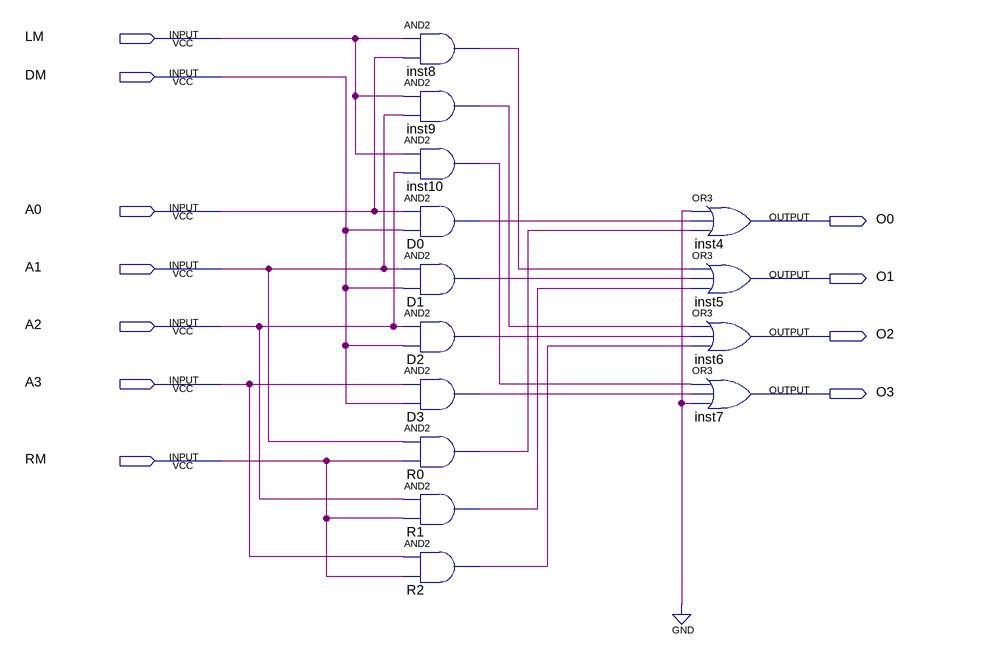
[diagram p0: schematic sheet]
// Quartus schematic simple1.bdf as structural Verilog: 14 symbols, 11 pins
module simple1 (
  input  LM,
  input  DM,
  input  A0,
  input  A1,
  input  A2,
  input  A3,
  input  RM,
  output O0,
  output O1,
  output O2,
  output O3
);

  wire D0_out, D1_out, D2_out, D3_out, inst8_out, inst9_out, inst10_out, R0_out, R1_out, R2_out;

  and inst8 (inst8_out, LM, A0);
  and inst9 (inst9_out, LM, A1);
  and inst10 (inst10_out, LM, A2);
  and D0 (D0_out, A0, DM);
  and D1 (D1_out, A1, DM);
  and D2 (D2_out, A2, DM);
  and D3 (D3_out, A3, DM);
  and R0 (R0_out, A1, RM);
  and R1 (R1_out, A2, RM);
  and R2 (R2_out, A3, RM);
  or inst4 (O0, 1'b0, D0_out, R0_out);
  or inst5 (O1, inst8_out, D1_out, R1_out);
  or inst6 (O2, inst9_out, D2_out, R2_out);
  or inst7 (O3, inst10_out, D3_out, 1'b0);
endmodule
